# EAGLE design LICL_Int (EAGLE 9.2.1)
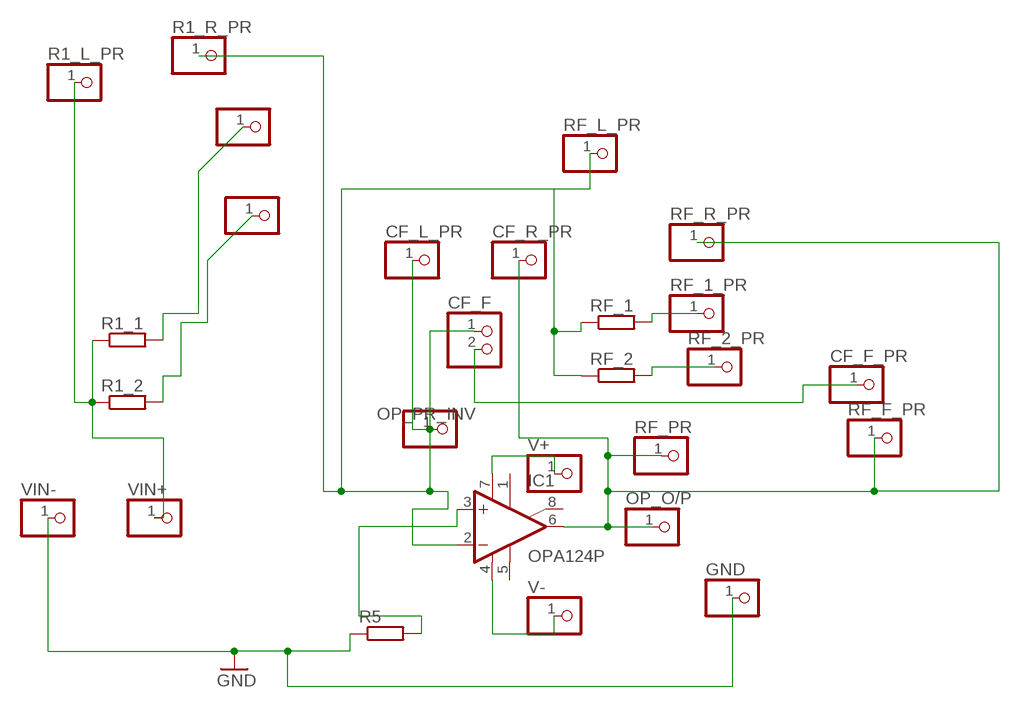
[diagram p0: schematic, sheet 1]

## Parts
CF_F  PINHD-1X2  [1X02]
CF_F_PR  PINHD-1X1  [1X01]
CF_L_PR  PINHD-1X1  [1X01]
CF_R_PR  PINHD-1X1  [1X01]
GND  PINHD-1X1  [1X01]
IC1  OPA124P  [DIL08]
OP_O/P  PINHD-1X1  [1X01]
R1_1  R-EU_0207/10  [0207/10]
R1_1_PR  PINHD-1X1  [1X01]
R1_2  R-EU_0207/10  [0207/10]
R1_2_PR  PINHD-1X1  [1X01]
R1_L_PR  PINHD-1X1  [1X01]
R1_PR  PINHD-1X1  [1X01]
R1_R_PR  PINHD-1X1  [1X01]
R5  R-EU_0207/10  [0207/10]
RF_1  R-EU_0207/10  [0207/10]
RF_1_PR  PINHD-1X1  [1X01]
RF_2  R-EU_0207/10  [0207/10]
RF_2_PR  PINHD-1X1  [1X01]
RF_F_PR  PINHD-1X1  [1X01]
RF_L_PR  PINHD-1X1  [1X01]
RF_PR  PINHD-1X1  [1X01]
RF_R_PR  PINHD-1X1  [1X01]
V+  PINHD-1X1  [1X01]
V-  PINHD-1X1  [1X01]
VIN+  PINHD-1X1  [1X01]
VIN-  PINHD-1X1  [1X01]

## Nets
GND: GND.1 R5.1 VIN-.1
N$1: R1_1.1 R1_2.1 R1_L_PR.1 VIN+.1
N$4: R1_1.2 R1_1_PR.1
N$5: R1_2.2 R1_2_PR.1
N$6: CF_R_PR.1 IC1.6(OUT) OP_O/P.1 RF_F_PR.1 RF_PR.1 RF_R_PR.1
N$8: IC1.3(+IN) R5.2
N$9: CF_F.2 CF_F_PR.1
N$12: RF_1.2 RF_1_PR.1
N$13: RF_2.2 RF_2_PR.1
N$14: IC1.7(V+) V+.1
N$15: IC1.4(V-) V-.1
OP_PR_INV: CF_F.1 CF_L_PR.1 IC1.2(-IN) R1_PR.1 R1_R_PR.1 RF_1.1 RF_2.1 RF_L_PR.1
Unconnected: IC1.1(TRIM1) IC1.5(TRIM2) IC1.8(SUBS)

## Library data of the parts
CF_F = pinhead:PINHD-1X2: PIN HEADER
CF_F_PR CF_L_PR CF_R_PR GND OP_O/P R1_1_PR R1_2_PR R1_L_PR R1_PR R1_R_PR RF_1_PR RF_2_PR RF_F_PR RF_L_PR RF_PR RF_R_PR V+ V- VIN+ VIN- = pinhead:PINHD-1X1: PIN HEADER
IC1 = burr-brown:OPA124: Difet Operational Amplifier Low Noise, Precision; OC_FARNELL: unknown; OC_NEWARK: unknown
R1_1 R1_2 R5 RF_1 RF_2 = resistor:R-EU_: RESISTOR, European symbol

## Board
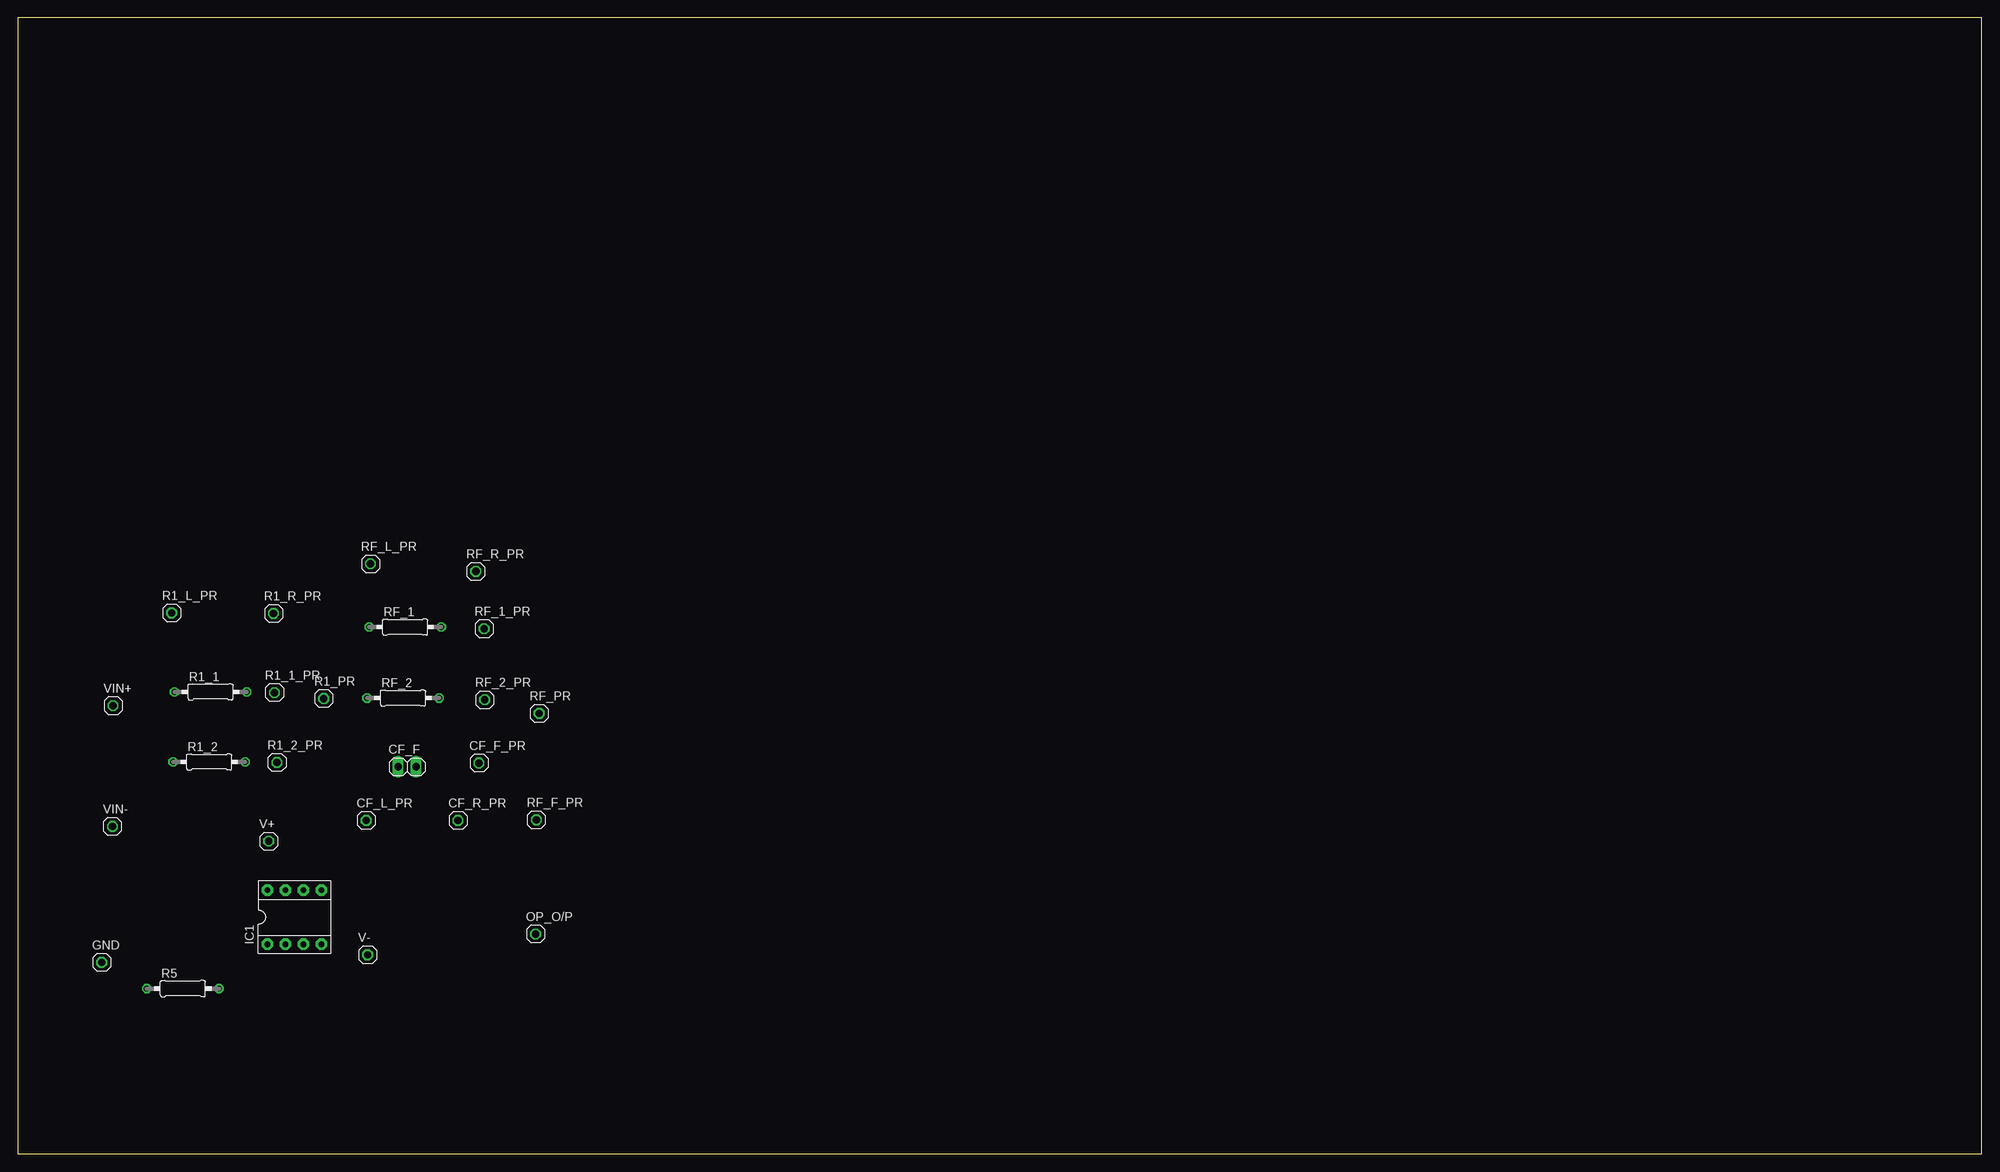
[diagram p1: board, top side]
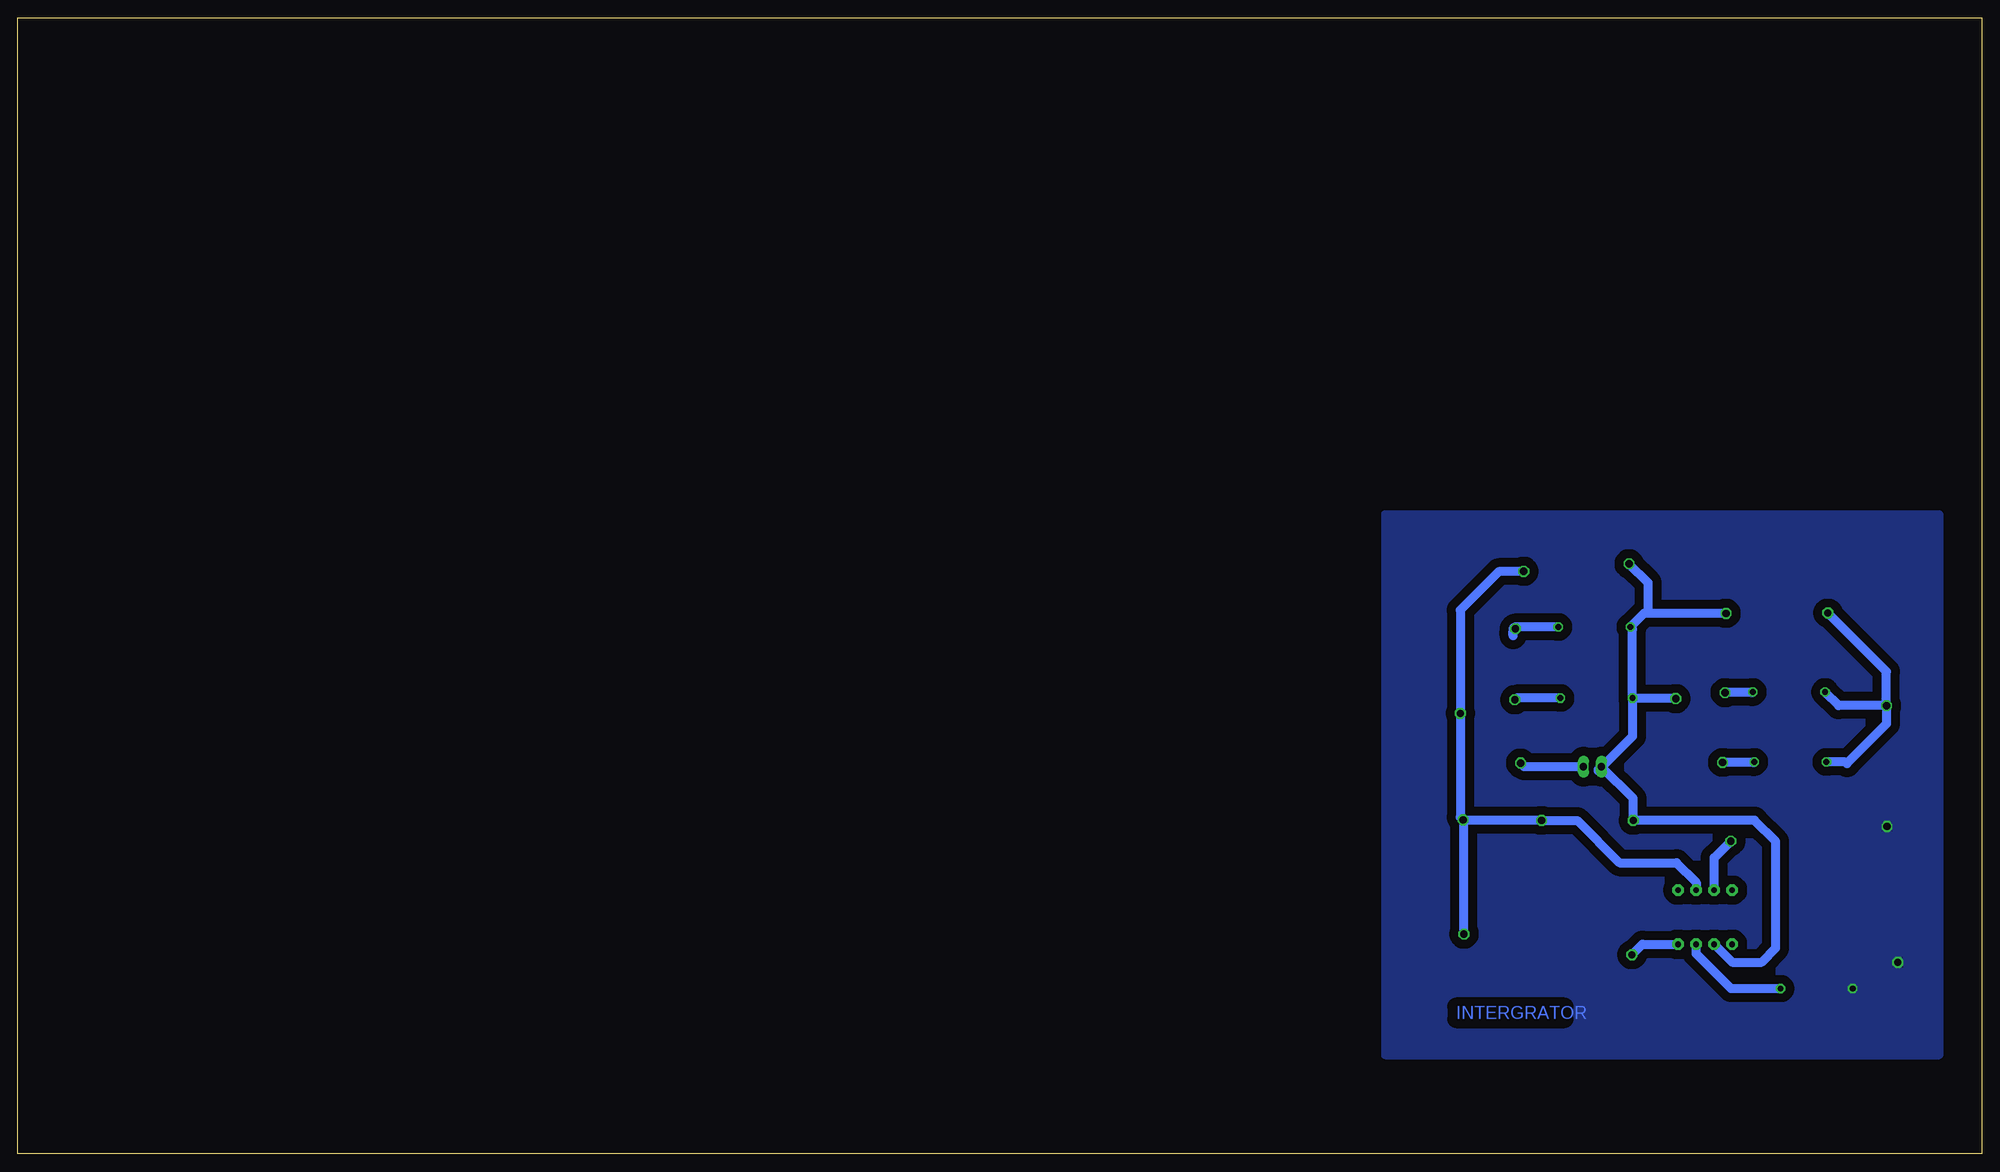
[diagram p2: board, bottom side, seen from below]

Size 276.53 x 160.01 mm. Coordinates in mm from the lower left corner, seen from the top.
Outline: 0,0 276.53,0 276.53,160.01 0,160.01 0,0
Copper layers (1*16): Top 0.035mm / dielectric 1.5mm / Bottom 0.035mm
Design rules "default": minimum track width 6mil, minimum drill 0.35mm, track to track 6mil, track to pad 6mil, pad to pad 6mil, via to via 6mil, smd to smd 6mil, copper to edge 40mil, drill to drill 6mil, minimum pad ring 10mil, minimum via ring 8mil, stop-mask expansion 4mil, vias tented up to drill 0mil, thermal gap 10mil

### Footprints (pad centres in the part's own frame; a part is rotated, then mirrored left to right if it is on the bottom)
1X02 = drill 1.016 long: 1 -1.27,0; 2 1.27,0
1X01 = drill 1.016 octagon: 1 0,0
DIL08 = drill 0.813 pad 1.6 octagon: 1 -3.81,-3.81; 2 -1.27,-3.81; 3 1.27,-3.81; 4 3.81,-3.81; 5 3.81,3.81; 6 1.27,3.81; 7 -1.27,3.81; 8 -3.81,3.81
0207/10 = drill 0.813 octagon: 1 -5.08,0; 2 5.08,0

### Placement (x,y rotation side)
CF_F  54.82,54.54 0 top
CF_F_PR  64.93,55.05 0 top
CF_L_PR  49.06,46.97 0 top
CF_R_PR  61.98,46.97 0 top
GND  11.82,26.97 0 top
IC1  38.95,33.35 0 top
OP_O/P  72.9,30.97 0 top
R1_1  27.15,65.07 0 top
R1_1_PR  36.14,64.97 0 top
R1_2  26.95,55.21 0 top
R1_2_PR  36.49,55.13 0 top
R1_L_PR  21.66,76.19 0 top
R1_PR  43.09,64.13 0 top
R1_R_PR  36.01,76.13 0 top
R5  23.25,23.29 0 top
RF_1  54.55,74.21 0 top
RF_1_PR  65.66,73.97 0 top
RF_2  54.25,64.21 0 top
RF_2_PR  65.74,63.97 0 top
RF_F_PR  73.01,47.05 0 top
RF_L_PR  49.66,83.11 0 top
RF_PR  73.41,62.05 0 top
RF_R_PR  64.49,82.05 0 top
V+  35.33,44.05 0 top
V-  49.25,28.05 0 top
VIN+  13.41,63.13 0 top
VIN-  13.33,46.13 0 top

### Tracks (layer width: path | path; a pad name or v marks a point on that pad's centre or on a via)
GND
  pour Bottom (isolate 1.27): 6,14 6,90 84,90 84,14
N$1
  Bottom 1.27: VIN+.1 20.13,63.13 R1_1.1 | VIN+.1 13.41,67.94 R1_L_PR.1 | VIN+.1 13.41,60.59 19,55 19.21,55.21 R1_2.1
N$4
  Bottom 1.27: R1_1.2 32.33,64.97 R1_1_PR.1
N$5
  Bottom 1.27: R1_2.2 32.11,55.13 R1_2_PR.1
N$6
  Bottom 1.27: RF_R_PR.1 64.54,82 68,82 73.41,76.59 RF_PR.1 73.41,47.45 RF_F_PR.1 | RF_F_PR.1 73.01,31.01 73,31 72.93,31 OP_O/P.1 | RF_F_PR.1 72.93,46.97 CF_R_PR.1 56.97,46.97 51,41 43,41 40.22,38.22 IC1.6
N$8
  Bottom 1.27: R5.2 35.29,23.29 40.22,28.22 IC1.3
N$9
  Bottom 1.27: CF_F.2 64.42,54.54 CF_F_PR.1
N$12
  Bottom 1.27: RF_1.2 65.79,74.21 66,74 66,73.63 | 66,73 66,73.63 | 66,73.63 RF_1_PR.1
N$13
  Bottom 1.27: RF_2.2 65.5,64.21 RF_2_PR.1
N$14
  Bottom 1.27: IC1.7 37.68,41.7 V+.1
N$15
  Bottom 1.27: V-.1 47.76,29.54 IC1.4
OP_PR_INV
  Bottom 1.27: R1_R_PR.1 47,76.13 | 47,76.13 47.55,76.13 RF_1.1 49.17,73.91 RF_2.1 | RF_L_PR.1 47,80.45 47,76.13 | IC1.2 35.14,27 31,27 29,29 29,44 32,47 32.03,46.97 CF_L_PR.1 49.06,50.05 CF_F.1 54,54.09 54,54 49.17,58.83 RF_2.1 | R1_PR.1 49.09,64.13 RF_2.1

### Text on the board
Bottom: INTERGRATOR